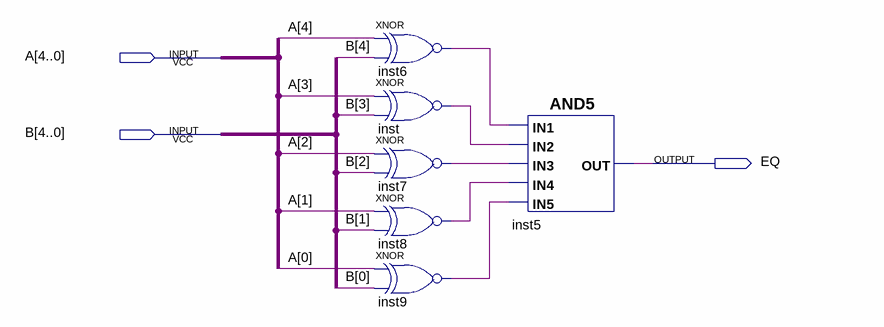
[diagram p0: schematic sheet]
// Quartus schematic comparator.bdf as structural Verilog: 6 symbols, 3 pins
module comparator (
  input  [4:0] A,
  input  [4:0] B,
  output EQ
);

  wire inst6_out, inst7_out, inst8_out, inst9_out, inst_out;

  xnor inst6 (inst6_out, A[4], B[4]);
  xnor inst (inst_out, A[3], B[3]);
  xnor inst7 (inst7_out, A[2], B[2]);
  xnor inst8 (inst8_out, A[1], B[1]);
  xnor inst9 (inst9_out, A[0], B[0]);
  and inst5 (EQ, inst6_out, inst_out, inst7_out, inst8_out, inst9_out);
endmodule
